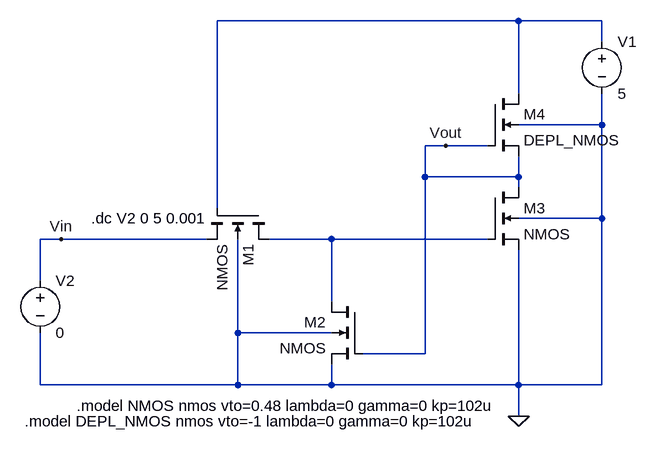
[diagram p0: schematic HW11.asc]
HW11.asc, the LTspice schematic file:
Version 4
SHEET 1 880 680
WIRE 496 -304 32 -304
WIRE 624 -304 496 -304
WIRE 624 -272 624 -304
WIRE 496 -192 496 -304
WIRE 624 -144 624 -192
WIRE 624 -144 496 -144
WIRE 384 -112 352 -112
WIRE 448 -112 384 -112
WIRE 352 -64 352 -112
WIRE 496 -64 496 -96
WIRE 496 -64 352 -64
WIRE 496 -48 496 -64
WIRE 32 -16 32 -304
WIRE 624 0 624 -144
WIRE 624 0 496 0
WIRE -208 32 -240 32
WIRE 16 32 -208 32
WIRE 208 32 112 32
WIRE 448 32 208 32
WIRE -240 96 -240 32
WIRE 208 128 208 32
WIRE 64 176 64 32
WIRE 208 176 64 176
WIRE 352 208 352 -64
WIRE 352 208 256 208
WIRE -240 256 -240 176
WIRE 64 256 64 176
WIRE 64 256 -240 256
WIRE 208 256 208 224
WIRE 208 256 64 256
WIRE 496 256 496 48
WIRE 496 256 208 256
WIRE 624 256 624 0
WIRE 624 256 496 256
WIRE 496 304 496 256
FLAG 496 304 0
FLAG 384 -112 Vout
FLAG -208 32 Vin
SYMBOL nmos4 112 -16 R90
SYMATTR InstName M1
SYMATTR Value2 l=1u w=2u
SYMBOL nmos4 256 128 M0
SYMATTR InstName M2
SYMATTR Value2 l=2u w=1u
SYMBOL nmos4 448 -48 R0
SYMATTR InstName M3
SYMATTR Value2 l=1u w=12u
SYMBOL nmos4 448 -192 R0
SYMATTR InstName M4
SYMATTR Value DEPL_NMOS
SYMATTR Value2 l=1u w=1u
SYMBOL voltage 624 -288 R0
SYMATTR InstName V1
SYMATTR Value 5
SYMBOL voltage -240 80 R0
SYMATTR InstName V2
SYMATTR Value 0
TEXT -184 288 Left 2 !.model NMOS nmos vto=0.48 lambda=0 gamma=0 kp=102u
TEXT -162 0 Left 2 !.dc V2 0 5 0.001
TEXT -264 312 Left 2 !.model DEPL_NMOS nmos vto=-1 lambda=0 gamma=0 kp=102u

The netlist it stands for:
* HW11.asc
M1 N002 N001 Vin 0 NMOS l=1u w=2u
M2 N002 Vout 0 0 NMOS l=2u w=1u
M3 Vout N002 0 0 NMOS l=1u w=12u
M4 N001 Vout Vout 0 DEPL_NMOS l=1u w=1u
V1 N001 0 5
V2 Vin 0 0
.model NMOS NMOS
.model PMOS PMOS
.lib standard.mos
.model NMOS nmos vto=0.48 lambda=0 gamma=0 kp=102u
.dc V2 0 5 0.001
.model DEPL_NMOS nmos vto=-1 lambda=0 gamma=0 kp=102u
.backanno
.end